# Altium schematic sheet LCDTFT_RTP_DRV_STMPE811.SchDoc
size A3; SheetNumber: 2; SheetTotal: 2
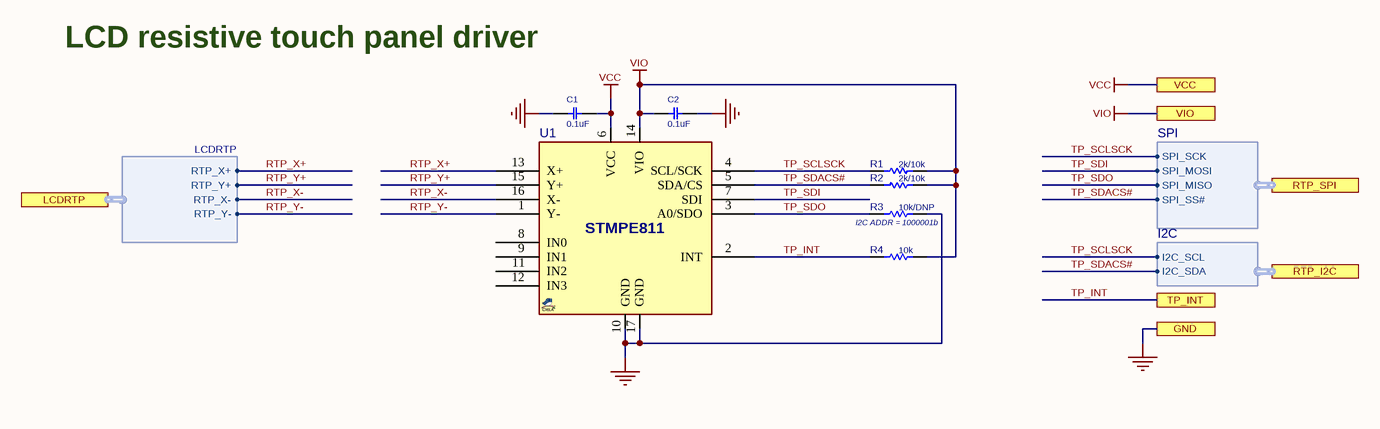
[diagram p0: LCDTFT_RTP_DRV_STMPE811.SchDoc]

## Parts
C1  0.1uF  [C0402]
C2  0.1uF  [C0402]
R1  2k/10k  [R0402]
R2  2k/10k  [R0402]
R3  10k/DNP  [R0402]
R4  10k  [R0402]
U1  STMPE811  [QFN50_16T_3X3]  (value not drawn)

## Ports
GND, LCDRTP (harness LCDRTP), RTP_I2C (harness I2C), RTP_SPI (harness SPI), TP_INT, VCC, VIO

## Harnesses
LCDRTP: RTP_X+, RTP_Y+, RTP_X-, RTP_Y-
SPI: SPI_SCK, SPI_MOSI, SPI_MISO, SPI_SS#
I2C: I2C_SCL, I2C_SDA

## Nets
GND: C1.1 C2.1 R3.1 U1.10(GND) U1.17(GND) ; port GND
VCC: C1.2 U1.6(VCC) ; port VCC
VIO: C2.2 R1.1 R2.1 R4.1 U1.14(VIO) ; port VIO
RTP_X+: U1.13(X+) ; port LCDRTP.RTP_X+
RTP_X-: U1.16(X-) ; port LCDRTP.RTP_X-
RTP_Y+: U1.15(Y+) ; port LCDRTP.RTP_Y+
RTP_Y-: U1.1(Y-) ; port LCDRTP.RTP_Y-
TP_INT: R4.2 U1.2(INT) ; port TP_INT
TP_SCLSCK: R1.2 U1.4(SCL/SCK) ; port RTP_SPI.SPI_SCK, port RTP_I2C.I2C_SCL
TP_SDACS#: R2.2 U1.5(SDA/CS) ; port RTP_SPI.SPI_SS#, port RTP_I2C.I2C_SDA
TP_SDI: U1.7(SDI) ; port RTP_SPI.SPI_MOSI
TP_SDO: R3.2 U1.3(A0/SDO) ; port RTP_SPI.SPI_MISO

Not connected (* = marked no-connect by the designer): U1 8(IN0) 9(IN1) 11(IN2) 12(IN3)

## Notes on the sheet
- LCD resistive touch panel driver
- (near R3) I2C ADDR = 1000001b

## Library data of the parts
C1 C2 = CAP_SMD_MLCC: CAP, MLCC; PARAM: X7R, 10%, -55~125oC; MANF_P#: GRM155R71H104KE14D; MANF: Murata; PARAM2: 50v; PRICE: 100: 0.018$; ASSEMBLY: ASSEMBLY; VALUE: 0.1uF
R1-R4 = RES_SMD: RESISTOR, SMD; PARAM: 0.063W; DESC: DESCRIPTION; DIST#: MOUSER; PARAM2: 1%; MANF_P#: -; MANF: -; ASSEMBLY: ASSEMBLY; PRICE: 100= 0.3$
  R1 R2: VALUE: 2k/10k
  R3: VALUE: 10k/DNP
  R4: VALUE: 10k
U1 = STMPE811_QFN16: LCD resistive touch panel driver; MANF: ST; MANF_P#: STMPE811Q; PARAM2: 1.8~3.3v; PRICE: 0.6$; VALUE: STMPE811